# Altium project Analog_drum.PrjPcb
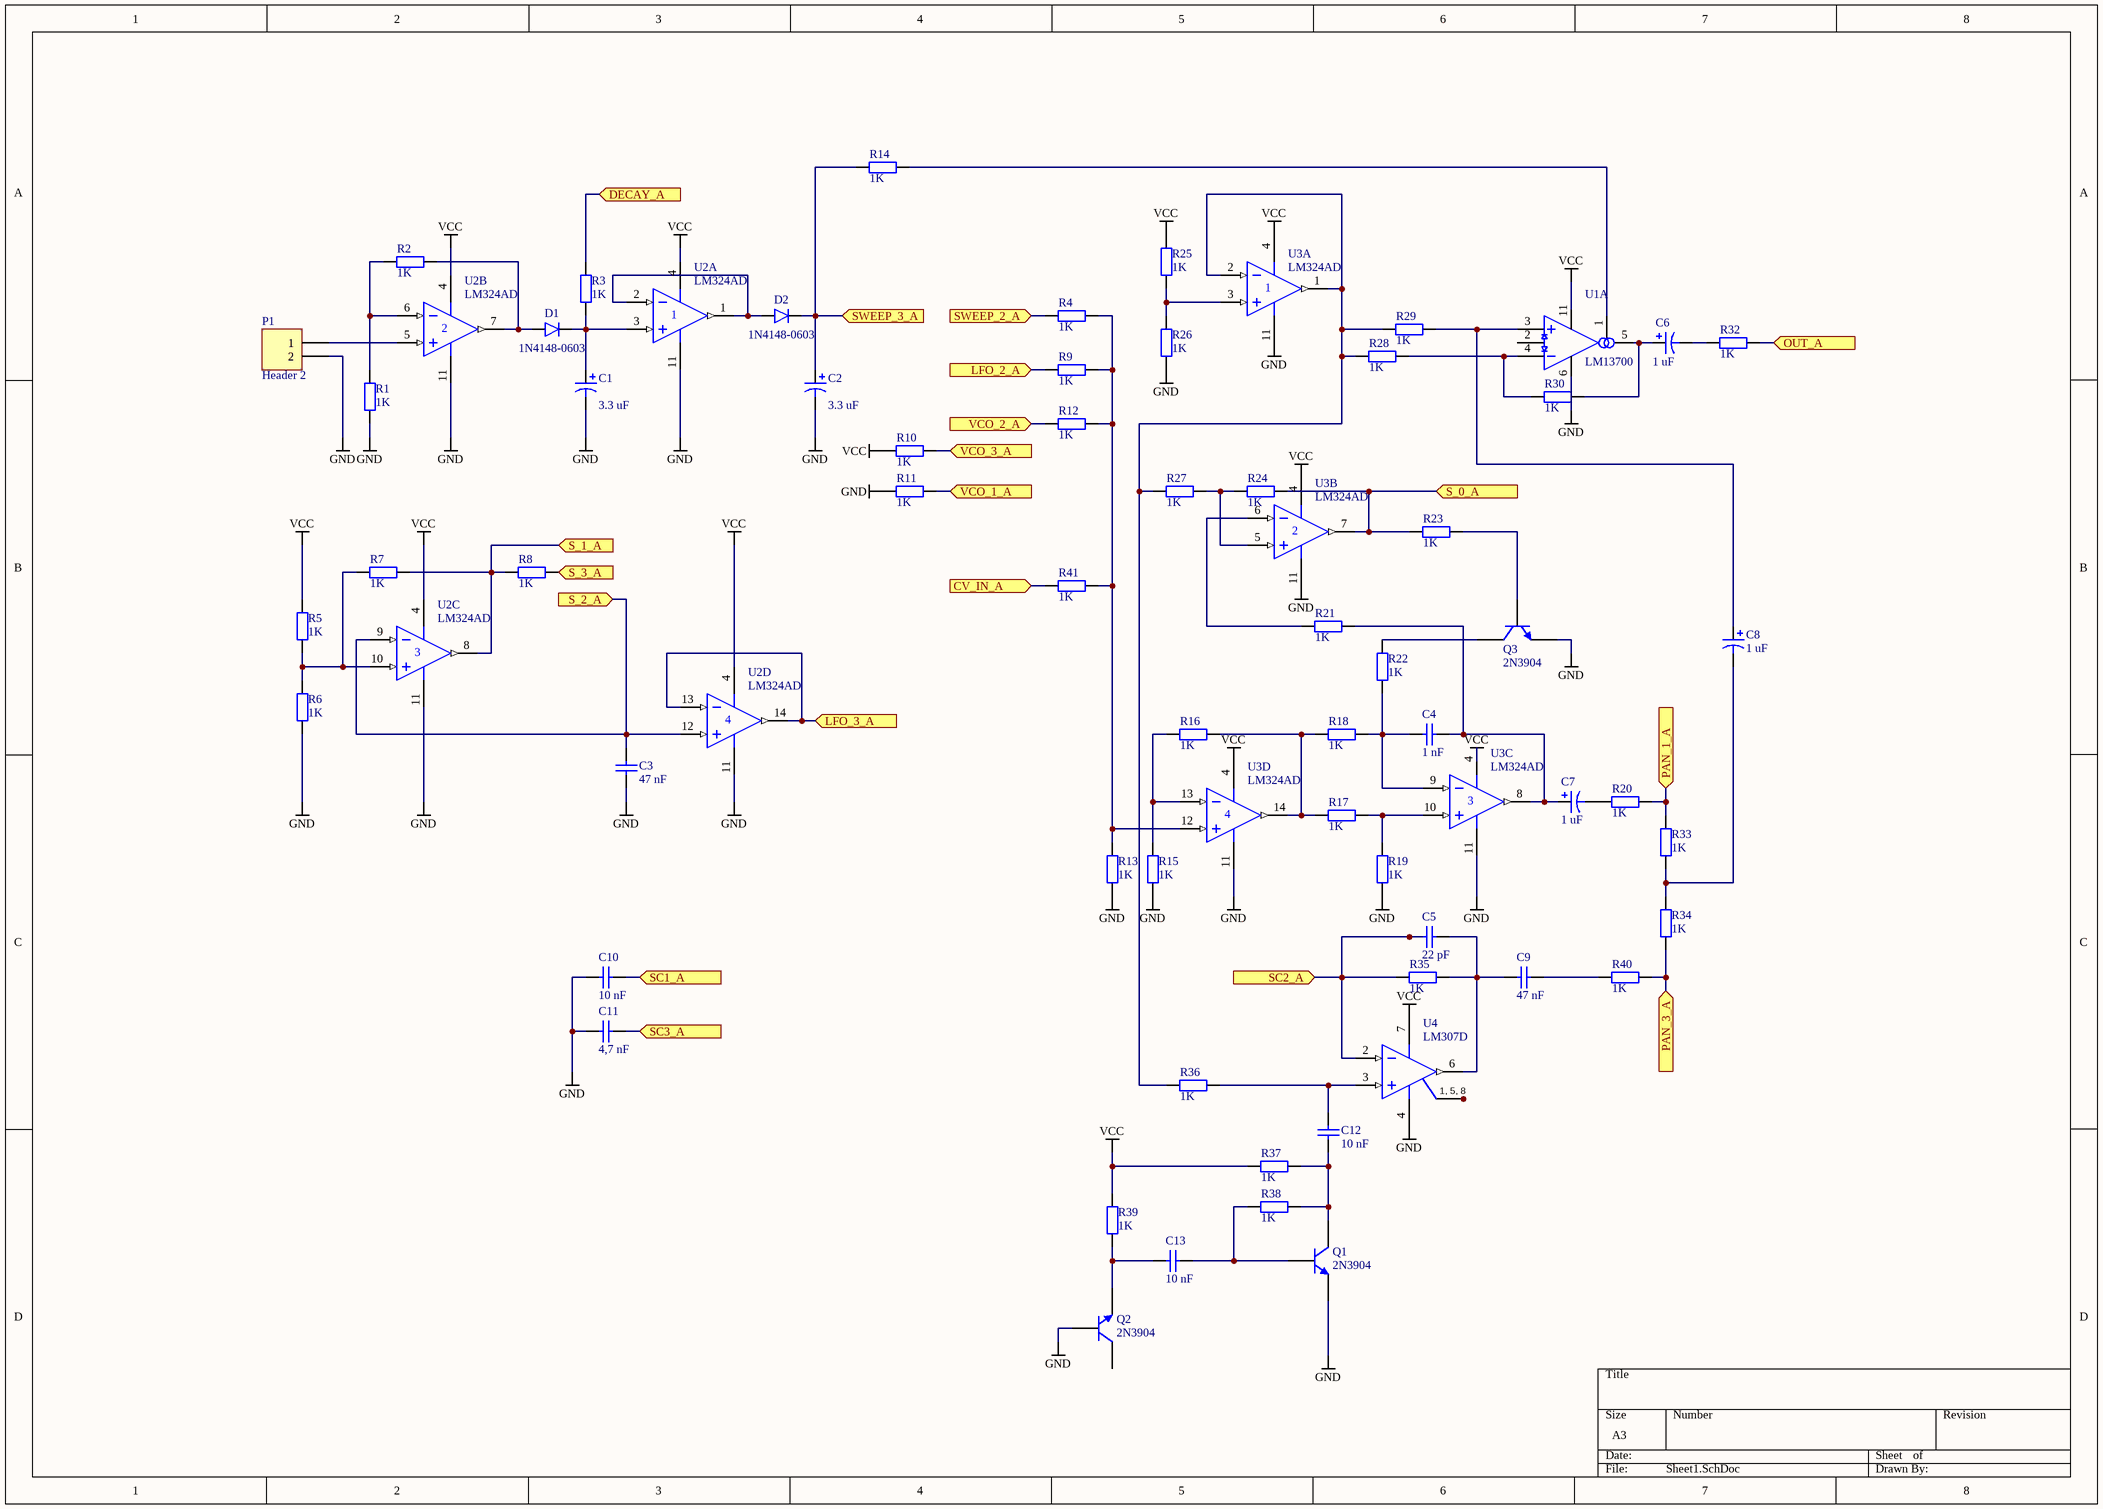
[diagram p0: Sheet1.SchDoc]
3 sheets, 150 parts. Net scope: flat (ports and power ports of the same name join across sheets).
Board file: PCB1.PcbDoc
Sheets:
  Sheet1.SchDoc
  Sheet2.SchDoc
  Sheet3.SchDoc

## Sheet Sheet1.SchDoc
size A3

### Parts
C1  value 3.3 uF  [C1206]  (hidden comment: Cap Pol1)
C2  value 3.3 uF  [C1206]  (hidden comment: Cap Pol1)
C3  value 47 nF  [C1206]  (hidden comment: Cap)
C4  value 1 nF  [C1206]  (hidden comment: Cap)
C5  value 22 pF  [C1206]  (hidden comment: Cap)
C6  value 1 uF  [C1206]  (hidden comment: Cap Pol1)
C7  value 1 uF  [C1206]  (hidden comment: Cap Pol1)
C8  value 1 uF  [C1206]  (hidden comment: Cap Pol1)
C9  value 47 nF  [C1206]  (hidden comment: Cap)
C10  value 10 nF  [C1206]  (hidden comment: Cap)
C11  value 4,7 nF  [C1206]  (hidden comment: Cap)
C12  value 10 nF  [C1206]  (hidden comment: Cap)
C13  value 10 nF  [C1206]  (hidden comment: Cap)
D1  1N4148-0603  [D0603]
D2  1N4148-0603  [D0603]
P1  Header 2  [HDR1X2]
Q1  2N3904  [TO-92A]
Q2  2N3904  [TO-92A]
Q3  2N3904  [TO-92A]
R1  value 1K  [R1206]  (hidden comment: Res2)
R2  value 1K  [R1206]  (hidden comment: Res2)
R3  value 1K  [R1206]  (hidden comment: Res2)
R4  value 1K  [R1206]  (hidden comment: Res2)
R5  value 1K  [R1206]  (hidden comment: Res2)
R6  value 1K  [R1206]  (hidden comment: Res2)
R7  value 1K  [R1206]  (hidden comment: Res2)
R8  value 1K  [R1206]  (hidden comment: Res2)
R9  value 1K  [R1206]  (hidden comment: Res2)
R10  value 1K  [R1206]  (hidden comment: Res2)
R11  value 1K  [R1206]  (hidden comment: Res2)
R12  value 1K  [R1206]  (hidden comment: Res2)
R13  value 1K  [R1206]  (hidden comment: Res2)
R14  value 1K  [R1206]  (hidden comment: Res2)
R15  value 1K  [R1206]  (hidden comment: Res2)
R16  value 1K  [R1206]  (hidden comment: Res2)
R17  value 1K  [R1206]  (hidden comment: Res2)
R18  value 1K  [R1206]  (hidden comment: Res2)
R19  value 1K  [R1206]  (hidden comment: Res2)
R20  value 1K  [R1206]  (hidden comment: Res2)
R21  value 1K  [R1206]  (hidden comment: Res2)
R22  value 1K  [R1206]  (hidden comment: Res2)
R23  value 1K  [R1206]  (hidden comment: Res2)
R24  value 1K  [R1206]  (hidden comment: Res2)
R25  value 1K  [R1206]  (hidden comment: Res2)
R26  value 1K  [R1206]  (hidden comment: Res2)
R27  value 1K  [R1206]  (hidden comment: Res2)
R28  value 1K  [R1206]  (hidden comment: Res2)
R29  value 1K  [R1206]  (hidden comment: Res2)
R30  value 1K  [R1206]  (hidden comment: Res2)
R32  value 1K  [R1206]  (hidden comment: Res2)
R33  value 1K  [R1206]  (hidden comment: Res2)
R34  value 1K  [R1206]  (hidden comment: Res2)
R35  value 1K  [R1206]  (hidden comment: Res2)
R36  value 1K  [R1206]  (hidden comment: Res2)
R37  value 1K  [R1206]  (hidden comment: Res2)
R38  value 1K  [R1206]  (hidden comment: Res2)
R39  value 1K  [R1206]  (hidden comment: Res2)
R40  value 1K  [R1206]  (hidden comment: Res2)
R41  value 1K  [R1206]  (hidden comment: Res2)
U1  LM13700  [SOIC16]  (part A of 2)
U2  LM324AD  [D014_N]  (parts A,B,C,D of 4)
U3  LM324AD  [D014_N]  (parts A,B,C,D of 4)
U4  LM307D  [D008_L]

### Ports
CV_IN_A, DECAY_A, LFO_2_A, LFO_3_A, OUT_A, PAN_1_A, PAN_3_A, S_0_A, S_1_A, S_2_A, S_3_A, SC1_A, SC2_A, SC3_A, SWEEP_2_A, SWEEP_3_A, VCO_1_A, VCO_2_A, VCO_3_A

### Nets
GND: C1.2 C2.2 C3.1 C10.2 C11.2 P1.2 Q1.1(E) Q2.2(B) Q3.1(E) R1.1 R6.1 R11.2 R13.2 R15.1 R19.2 R26.2 U1.6(V-) U2.11(V-) U3.11(V-) U4.4(V-)
VCC: R5.2 R10.1 R25.1 R37.2 R39.1 U1.11(V+) U2.4(V+) U3.4(V+) U4.7(V+)
NetC1_1: C1.1 D1.1 R3.2 U2.3(IN+)
NetC2_1: C2.1 D2.1 R14.1 ; port SWEEP_3_A
NetC3_2: C3.2 U2.9(IN-) U2.12(IN+) ; port S_2_A
NetC4_1: C4.1 C7.1 R21.2 U3.8(OUT)
NetC4_2: C4.2 R18.1 R22.1 U3.9(IN-)
NetC5_1: C5.1 C9.1 R35.1 U4.6(OUT)
NetC5_2: C5.2 R35.2 U4.2(IN-) ; port SC2_A
NetC6_1: C6.1 R30.2 U1.5(amp_bias)
NetC6_2: C6.2 R32.1
NetC7_2: C7.2 R20.1
NetC8_1: C8.1 R29.2 U1.3(+)
NetC8_2: C8.2 R33.1 R34.2
NetC9_2: C9.2 R40.1
NetC10_1: C10.1 ; port SC1_A
NetC11_1: C11.1 ; port SC3_A
NetC12_1: C12.1 R36.1 U4.3(IN+)
NetC12_2: C12.2 Q1.3(C) R37.1 R38.1
NetC13_1: C13.1 Q2.1(E) R39.2
NetC13_2: C13.2 Q1.2(B) R38.2
NetD1_2: D1.2 R2.1 U2.7(OUT)
NetD2_2: D2.2 U2.1(OUT) U2.2(IN-)
NetP1_1: P1.1 U2.5(IN+)
NetP202_1: R41.1 ; port CV_IN_A
NetPot1_1: R3.1 ; port DECAY_A
NetPot2_2: R4.1 ; port SWEEP_2_A
NetPot3_1: R8.1 ; port S_3_A
NetPot4_2: R9.2 ; port LFO_2_A
NetPot4_3: U2.13(IN-) U2.14(OUT) ; port LFO_3_A
NetPot5_1: R11.1 ; port VCO_1_A
NetPot5_2: R12.2 ; port VCO_2_A
NetPot5_3: R10.2 ; port VCO_3_A
NetPot6_1: R20.2 R33.2 ; port PAN_1_A
NetPot6_3: R34.1 R40.2 ; port PAN_3_A
NetPot7_1: R32.2 ; port OUT_A
NetQ3_2: Q3.2(B) R23.1
NetQ3_3: Q3.3(C) R22.2
NetR1_2: R1.2 R2.2 U2.6(IN-)
NetR4_2: R4.2 R9.1 R12.1 R13.1 R41.2 U3.12(IN+)
NetR5_1: R5.1 R6.2 R7.2 U2.10(IN+)
NetR7_1: R7.1 R8.2 U2.8(OUT) ; port S_1_A
NetR14_2: R14.2 U1.1(amp_bias)
NetR15_2: R15.2 R16.2 U3.13(IN-)
NetR16_1: R16.1 R17.2 R18.2 U3.14(OUT)
NetR17_1: R17.1 R19.1 U3.10(IN+)
NetR21_1: R21.1 U3.6(IN-)
NetR23_2: R23.2 R24.1 U3.7(OUT) ; port S_0_A
NetR24_2: R24.2 R27.2 U3.5(IN+)
NetR25_2: R25.2 R26.1 U3.3(IN+)
NetR27_1: R27.1 R28.1 R29.1 R36.2 U3.1(OUT) U3.2(IN-)
NetR28_2: R28.2 R30.1 U1.4(amp_bias)
NetU4_1: U4.1(NC) U4.5(NC) U4.8(NC)

Not connected (* = marked no-connect by the designer): Q2 3(C); U1 2(amp_bias)

### Notes on the sheet
- (in symbol LM307D) 1, 5, 8

### Library data of the parts
C1 C2 C6-C8 = Cap Pol1: Polarized Capacitor (Radial); Published: 8-Jun-2000; LatestRevisionDate: 17-Jul-2002; LatestRevisionNote: Re-released for DXP Platform.; PackageReference: RB7.6-15; Publisher: Altium Limited; PackageDescription: Polarized Capacitor (Radial); 2 Leads
C3-C5 C9-C13 = Cap: Capacitor; Published: 8-Jun-2000; LatestRevisionDate: 17-Jul-2002; LatestRevisionNote: Re-released for DXP Platform.; PackageReference: RAD-0.3; Publisher: Altium Limited; PackageDescription: Radial Cap, Thru-Hole; 2 Leads; 0.3 in Pin Spacing
D1 D2 = 1N4148: Dioda: przełączająca; SMD; 100V; 150mA; 4ns; 0603; Manufacture: DC COMPONENTS; Shop1: TME; DafaultFootprint: 0603; Value1: 75V; Parameter1: Vr; Parameter2: If; ComponentLink1URL: http://www.tme.eu/pl/Document/56f18f971963fb7c3e40973a6fd3d82c/CD4148W_WT.pdf; ComponentLink2URL: *; ComponentLink1Description: Datasheet; ComponentLink2Description: *; Tolerance1: *; Shop1ID: *; ComponentType: Diod Rectifier; Assembly: SMD; Replacement: *; ComponentSymbol: 1N4148-0603; Value2: 150mA
P1 = Header 2: Header, 2-Pin; LatestRevisionDate: 17-Jul-2002; LatestRevisionNote: Re-released for DXP Platform.; Publisher: Altium Limited
Q1-Q3 = 2N3904: NPN General Purpose Amplifier; Published: 8-Jun-2000; LatestRevisionDate: 15-Jan-2003; LatestRevisionNote: PCB Footprint 'BCY-W3/D4.7' replaced; DatasheetVersion: 1997; PackageVersion: Sep-1998; PackageReference: TO-92A; Publisher: Altium Limited; PackageDescription: TO, Flat Index; 3 In-Line, Axial Leads; Body Dia. 4.5mm; Leads 0.51 x 0.48 mm (max); ComponentLink1Description: Manufacturer Link; ComponentLink1URL: http://www.fairchildsemi.com/; ComponentLink2Description: Datasheet; ComponentLink2URL: http://www.fairchildsemi.com/ds/2N%2F2N3904.pdf
R1-R30 R32-R41 = Res2: Resistor; Published: 8-Jun-2000; LatestRevisionDate: 17-Jul-2002; LatestRevisionNote: Re-released for DXP Platform.; PackageReference: AXIAL-0.4; Publisher: Altium Limited; PackageDescription: Axial Device, Thru-Hole; 2 Leads; 0.4 in Pin Spacing
U2 U3 = LM324AD: Quadruple Operational Amplifier; Published: 15-Apr-2002; LatestRevisionDate: 13-Apr-2006; LatestRevisionNote: IPC-7351 Footprint Added.; DatasheetVersion: Jan-1989; PackageVersion: Jan-1998; PackageReference: D014; Publisher: Altium Limited; PackageDescription: 14-Pin Small Outline Integrated Circuit 1.27 mm Pitch; Code_IPC: SOIC127P600-14; ComponentLink1Description: Manufacturer Link; ComponentLink1URL: http://www.ti.com/; ComponentLink2Description: Datasheet; ComponentLink2URL: http://www-s.ti.com/sc/ds/lm324.pdf
U4 = LM307D: High-Performance Operational Amplifier; Published: 15-Apr-2002; LatestRevisionDate: 13-Apr-2006; LatestRevisionNote: IPC-7351 Footprint Added.; DatasheetVersion: Jun-1988; PackageVersion: Jan-1998; PackageReference: D008; Publisher: Altium Limited; PackageDescription: 8-Pin Small Outline Integrated Circuit 1.27 mm Pitch; Code_IPC: SOIC127P600-8; ComponentLink1Description: Manufacturer Link; ComponentLink1URL: http://www.ti.com/; ComponentLink2Description: Datasheet; ComponentLink2URL: http://www-s.ti.com/sc/ds/lm307.pdf

## Sheet Sheet2.SchDoc
size A3
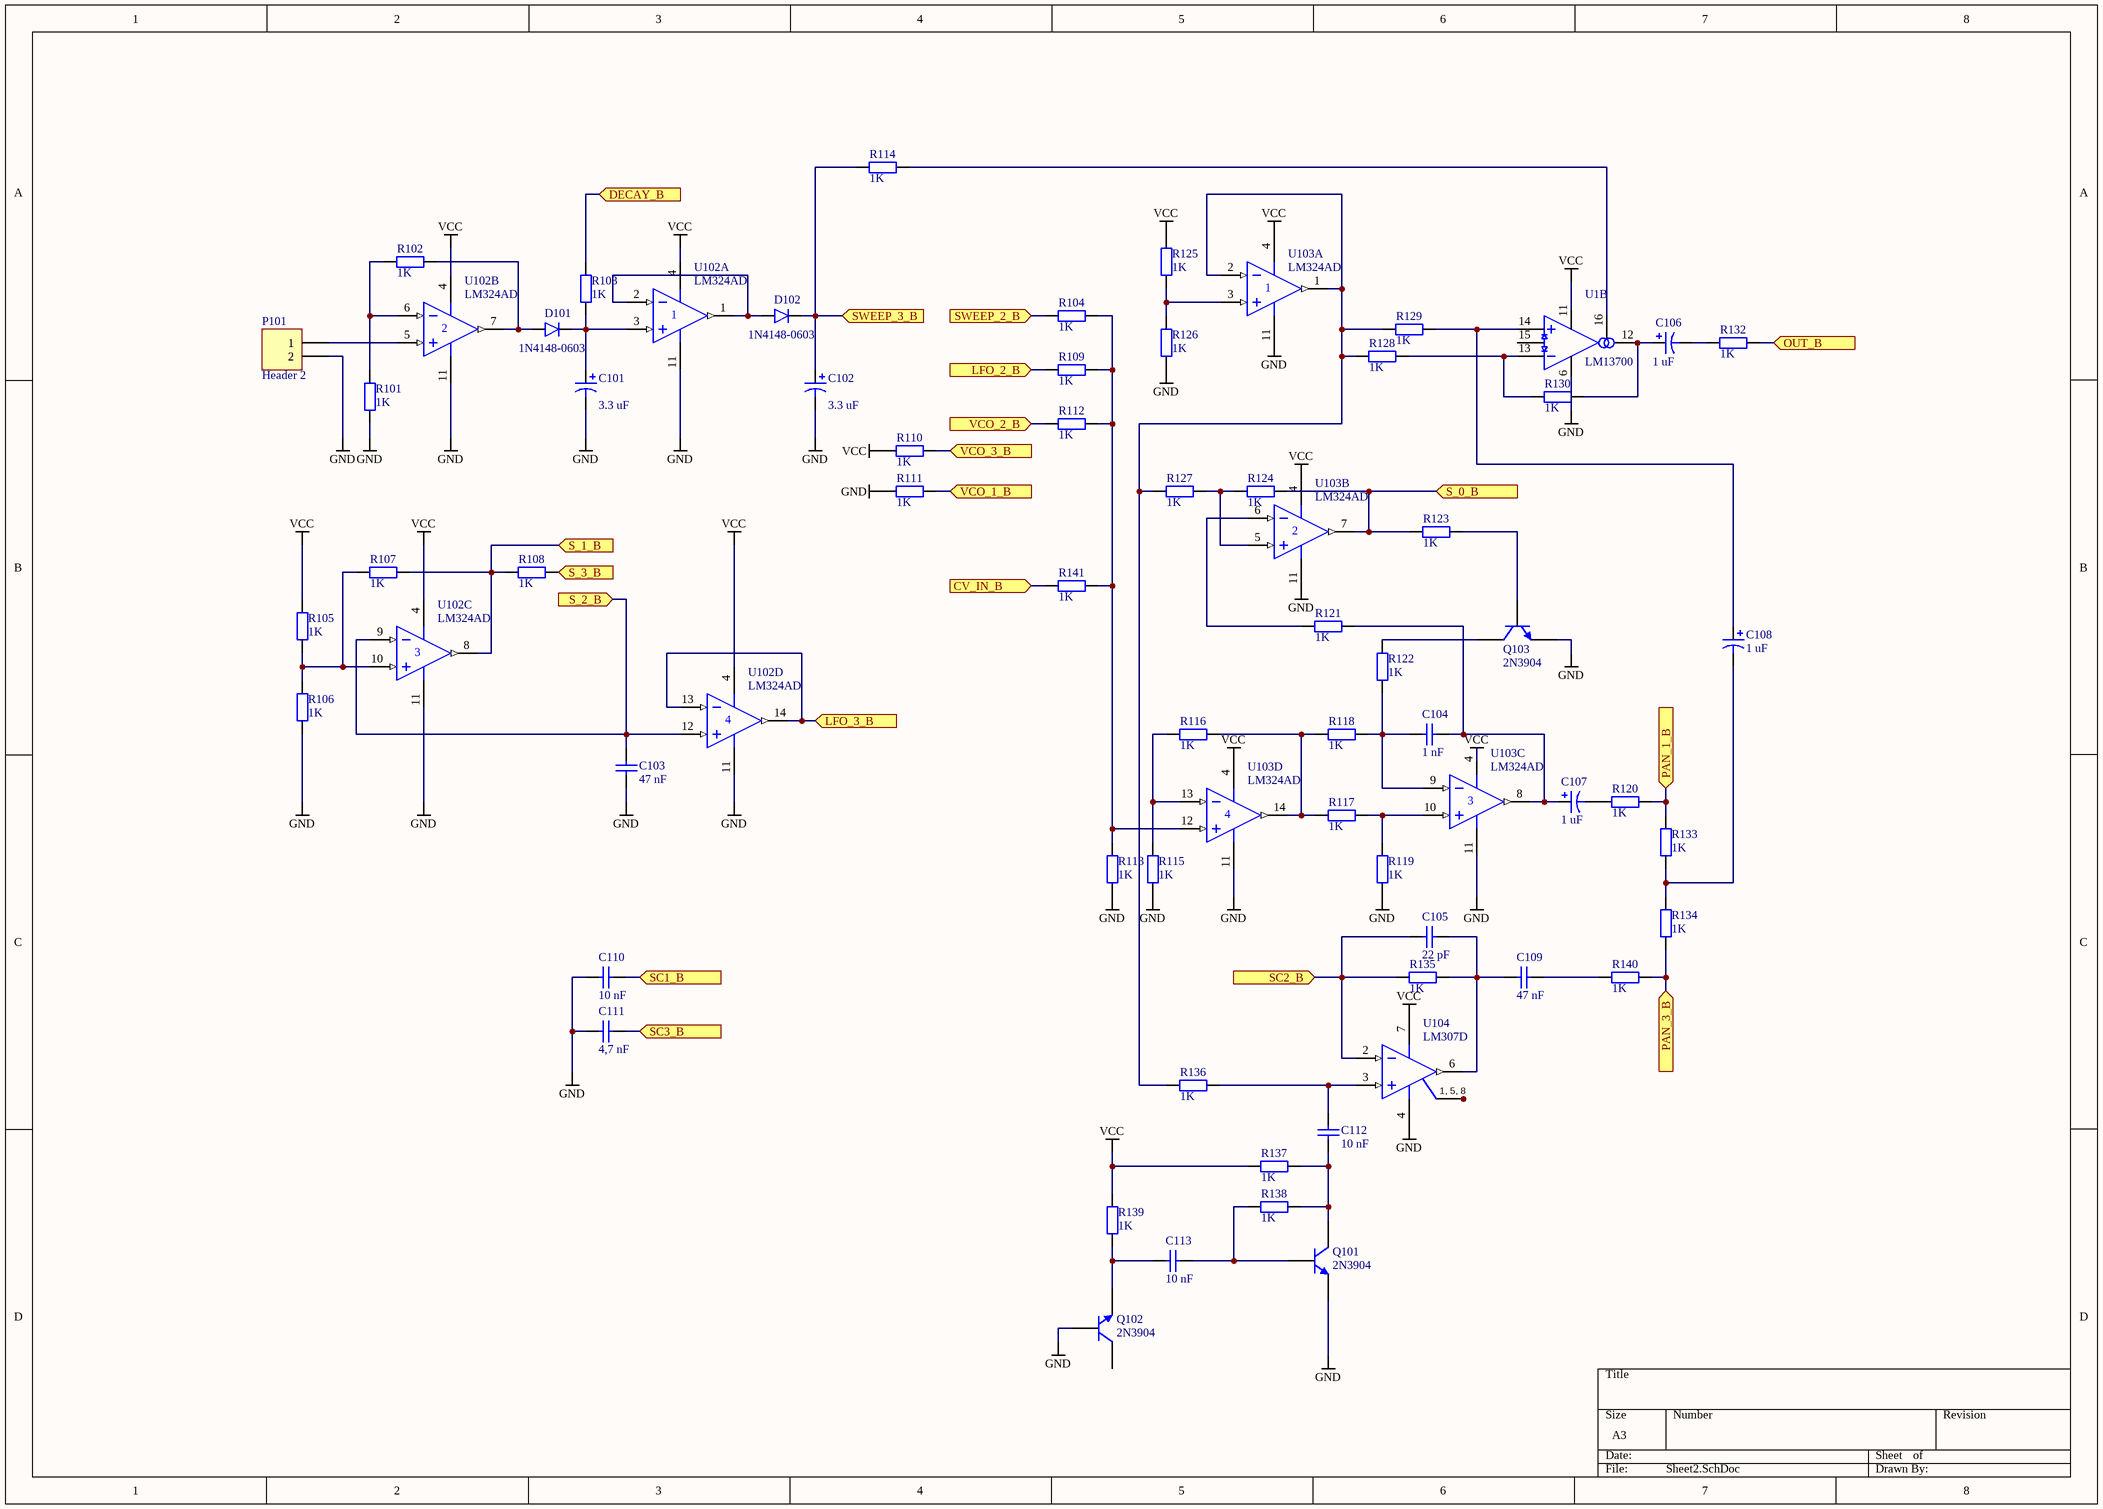
[diagram p1: Sheet2.SchDoc]

### Parts
C101  value 3.3 uF  [C1206]  (hidden comment: Cap Pol1)
C102  value 3.3 uF  [C1206]  (hidden comment: Cap Pol1)
C103  value 47 nF  [C1206]  (hidden comment: Cap)
C104  value 1 nF  [C1206]  (hidden comment: Cap)
C105  value 22 pF  [C1206]  (hidden comment: Cap)
C106  value 1 uF  [C1206]  (hidden comment: Cap Pol1)
C107  value 1 uF  [C1206]  (hidden comment: Cap Pol1)
C108  value 1 uF  [C1206]  (hidden comment: Cap Pol1)
C109  value 47 nF  [C1206]  (hidden comment: Cap)
C110  value 10 nF  [C1206]  (hidden comment: Cap)
C111  value 4,7 nF  [C1206]  (hidden comment: Cap)
C112  value 10 nF  [C1206]  (hidden comment: Cap)
C113  value 10 nF  [C1206]  (hidden comment: Cap)
D101  1N4148-0603  [D0603]
D102  1N4148-0603  [D0603]
P101  Header 2  [HDR1X2]
Q101  2N3904  [TO-92A]
Q102  2N3904  [TO-92A]
Q103  2N3904  [TO-92A]
R101  value 1K  [R1206]  (hidden comment: Res2)
R102  value 1K  [R1206]  (hidden comment: Res2)
R103  value 1K  [R1206]  (hidden comment: Res2)
R104  value 1K  [R1206]  (hidden comment: Res2)
R105  value 1K  [R1206]  (hidden comment: Res2)
R106  value 1K  [R1206]  (hidden comment: Res2)
R107  value 1K  [R1206]  (hidden comment: Res2)
R108  value 1K  [R1206]  (hidden comment: Res2)
R109  value 1K  [R1206]  (hidden comment: Res2)
R110  value 1K  [R1206]  (hidden comment: Res2)
R111  value 1K  [R1206]  (hidden comment: Res2)
R112  value 1K  [R1206]  (hidden comment: Res2)
R113  value 1K  [R1206]  (hidden comment: Res2)
R114  value 1K  [R1206]  (hidden comment: Res2)
R115  value 1K  [R1206]  (hidden comment: Res2)
R116  value 1K  [R1206]  (hidden comment: Res2)
R117  value 1K  [R1206]  (hidden comment: Res2)
R118  value 1K  [R1206]  (hidden comment: Res2)
R119  value 1K  [R1206]  (hidden comment: Res2)
R120  value 1K  [R1206]  (hidden comment: Res2)
R121  value 1K  [R1206]  (hidden comment: Res2)
R122  value 1K  [R1206]  (hidden comment: Res2)
R123  value 1K  [R1206]  (hidden comment: Res2)
R124  value 1K  [R1206]  (hidden comment: Res2)
R125  value 1K  [R1206]  (hidden comment: Res2)
R126  value 1K  [R1206]  (hidden comment: Res2)
R127  value 1K  [R1206]  (hidden comment: Res2)
R128  value 1K  [R1206]  (hidden comment: Res2)
R129  value 1K  [R1206]  (hidden comment: Res2)
R130  value 1K  [R1206]  (hidden comment: Res2)
R132  value 1K  [R1206]  (hidden comment: Res2)
R133  value 1K  [R1206]  (hidden comment: Res2)
R134  value 1K  [R1206]  (hidden comment: Res2)
R135  value 1K  [R1206]  (hidden comment: Res2)
R136  value 1K  [R1206]  (hidden comment: Res2)
R137  value 1K  [R1206]  (hidden comment: Res2)
R138  value 1K  [R1206]  (hidden comment: Res2)
R139  value 1K  [R1206]  (hidden comment: Res2)
R140  value 1K  [R1206]  (hidden comment: Res2)
R141  value 1K  [R1206]  (hidden comment: Res2)
U1  LM13700  [SOIC16]  (part B of 2)
U102  LM324AD  [D014_N]  (parts A,B,C,D of 4)
U103  LM324AD  [D014_N]  (parts A,B,C,D of 4)
U104  LM307D  [D008_L]

### Ports
CV_IN_B, DECAY_B, LFO_2_B, LFO_3_B, OUT_B, PAN_1_B, PAN_3_B, S_0_B, S_1_B, S_2_B, S_3_B, SC1_B, SC2_B, SC3_B, SWEEP_2_B, SWEEP_3_B, VCO_1_B, VCO_2_B, VCO_3_B

### Nets
GND: C101.2 C102.2 C103.1 C110.2 C111.2 P101.2 Q101.1(E) Q102.2(B) Q103.1(E) R101.1 R106.1 R111.2 R113.2 R115.1 R119.2 R126.2 U1.6(V-) U102.11(V-) U103.11(V-) U104.4(V-)
VCC: R105.2 R110.1 R125.1 R137.2 R139.1 U1.11(V+) U102.4(V+) U103.4(V+) U104.7(V+)
NetC101_1: C101.1 D101.1 R103.2 U102.3(IN+)
NetC102_1: C102.1 D102.1 R114.1 ; port SWEEP_3_B
NetC103_2: C103.2 U102.9(IN-) U102.12(IN+) ; port S_2_B
NetC104_1: C104.1 C107.1 R121.2 U103.8(OUT)
NetC104_2: C104.2 R118.1 R122.1 U103.9(IN-)
NetC105_1: C105.1 C109.1 R135.1 U104.6(OUT)
NetC105_2: C105.2 R135.2 U104.2(IN-) ; port SC2_B
NetC106_1: C106.1 R130.2 U1.12(amp_bias)
NetC106_2: C106.2 R132.1
NetC107_2: C107.2 R120.1
NetC108_1: C108.1 R129.2 U1.14(+)
NetC108_2: C108.2 R133.1 R134.2
NetC109_2: C109.2 R140.1
NetC110_1: C110.1 ; port SC1_B
NetC111_1: C111.1 ; port SC3_B
NetC112_1: C112.1 R136.1 U104.3(IN+)
NetC112_2: C112.2 Q101.3(C) R137.1 R138.1
NetC113_1: C113.1 Q102.1(E) R139.2
NetC113_2: C113.2 Q101.2(B) R138.2
NetD101_2: D101.2 R102.1 U102.7(OUT)
NetD102_2: D102.2 U102.1(OUT) U102.2(IN-)
NetP101_1: P101.1 U102.5(IN+)
NetP204_1: R141.1 ; port CV_IN_B
NetPot8_1: R103.1 ; port DECAY_B
NetPot9_2: R104.1 ; port SWEEP_2_B
NetPot10_1: R108.1 ; port S_3_B
NetPot11_2: R109.2 ; port LFO_2_B
NetPot11_3: U102.13(IN-) U102.14(OUT) ; port LFO_3_B
NetPot12_1: R111.1 ; port VCO_1_B
NetPot12_2: R112.2 ; port VCO_2_B
NetPot12_3: R110.2 ; port VCO_3_B
NetPot13_1: R120.2 R133.2 ; port PAN_1_B
NetPot13_3: R134.1 R140.2 ; port PAN_3_B
NetPot14_1: R132.2 ; port OUT_B
NetQ103_2: Q103.2(B) R123.1
NetQ103_3: Q103.3(C) R122.2
NetR101_2: R101.2 R102.2 U102.6(IN-)
NetR104_2: R104.2 R109.1 R112.1 R113.1 R141.2 U103.12(IN+)
NetR105_1: R105.1 R106.2 R107.2 U102.10(IN+)
NetR107_1: R107.1 R108.2 U102.8(OUT) ; port S_1_B
NetR114_2: R114.2 U1.16(amp_bias)
NetR115_2: R115.2 R116.2 U103.13(IN-)
NetR116_1: R116.1 R117.2 R118.2 U103.14(OUT)
NetR117_1: R117.1 R119.1 U103.10(IN+)
NetR121_1: R121.1 U103.6(IN-)
NetR123_2: R123.2 R124.1 U103.7(OUT) ; port S_0_B
NetR124_2: R124.2 R127.2 U103.5(IN+)
NetR125_2: R125.2 R126.1 U103.3(IN+)
NetR127_1: R127.1 R128.1 R129.1 R136.2 U103.1(OUT) U103.2(IN-)
NetR128_2: R128.2 R130.1 U1.13(amp_bias)
NetU104_1: U104.1(NC) U104.5(NC) U104.8(NC)

Not connected (* = marked no-connect by the designer): Q102 3(C); U1 15(amp_bias)

### Notes on the sheet
- (in symbol LM307D) 1, 5, 8

### Library data of the parts
C101 C102 C106-C108 = Cap Pol1: Polarized Capacitor (Radial); Published: 8-Jun-2000; LatestRevisionDate: 17-Jul-2002; LatestRevisionNote: Re-released for DXP Platform.; PackageReference: RB7.6-15; Publisher: Altium Limited; PackageDescription: Polarized Capacitor (Radial); 2 Leads
C103-C105 C109-C113 = Cap: Capacitor; Published: 8-Jun-2000; LatestRevisionDate: 17-Jul-2002; LatestRevisionNote: Re-released for DXP Platform.; PackageReference: RAD-0.3; Publisher: Altium Limited; PackageDescription: Radial Cap, Thru-Hole; 2 Leads; 0.3 in Pin Spacing
D101 D102 = 1N4148: as D1 on sheet Sheet1; ComponentLink1URL: http://www.tme.eu/pl/Document/56f18f971963fb7c3e40973a6fd3d82c/CD4148W_WT.pdf; ComponentLink2URL: *; ComponentLink1Description: Datasheet; ComponentLink2Description: *; Tolerance1: *; Shop1ID: *; ComponentType: Diod Rectifier; Assembly: SMD; Replacement: *; ComponentSymbol: 1N4148-0603; Value2: 150mA
P101 = Header 2: Header, 2-Pin; LatestRevisionDate: 17-Jul-2002; LatestRevisionNote: Re-released for DXP Platform.; Publisher: Altium Limited
Q101-Q103 = 2N3904: NPN General Purpose Amplifier; Published: 8-Jun-2000; LatestRevisionDate: 15-Jan-2003; LatestRevisionNote: PCB Footprint 'BCY-W3/D4.7' replaced; DatasheetVersion: 1997; PackageVersion: Sep-1998; PackageReference: TO-92A; Publisher: Altium Limited; PackageDescription: TO, Flat Index; 3 In-Line, Axial Leads; Body Dia. 4.5mm; Leads 0.51 x 0.48 mm (max); ComponentLink1Description: Manufacturer Link; ComponentLink1URL: http://www.fairchildsemi.com/; ComponentLink2Description: Datasheet; ComponentLink2URL: http://www.fairchildsemi.com/ds/2N%2F2N3904.pdf
R101-R130 R132-R141 = Res2: Resistor; Published: 8-Jun-2000; LatestRevisionDate: 17-Jul-2002; LatestRevisionNote: Re-released for DXP Platform.; PackageReference: AXIAL-0.4; Publisher: Altium Limited; PackageDescription: Axial Device, Thru-Hole; 2 Leads; 0.4 in Pin Spacing
U102 U103 = LM324AD: Quadruple Operational Amplifier; Published: 15-Apr-2002; LatestRevisionDate: 13-Apr-2006; LatestRevisionNote: IPC-7351 Footprint Added.; DatasheetVersion: Jan-1989; PackageVersion: Jan-1998; PackageReference: D014; Publisher: Altium Limited; PackageDescription: 14-Pin Small Outline Integrated Circuit 1.27 mm Pitch; Code_IPC: SOIC127P600-14; ComponentLink1Description: Manufacturer Link; ComponentLink1URL: http://www.ti.com/; ComponentLink2Description: Datasheet; ComponentLink2URL: http://www-s.ti.com/sc/ds/lm324.pdf
U104 = LM307D: High-Performance Operational Amplifier; Published: 15-Apr-2002; LatestRevisionDate: 13-Apr-2006; LatestRevisionNote: IPC-7351 Footprint Added.; DatasheetVersion: Jun-1988; PackageVersion: Jan-1998; PackageReference: D008; Publisher: Altium Limited; PackageDescription: 8-Pin Small Outline Integrated Circuit 1.27 mm Pitch; Code_IPC: SOIC127P600-8; ComponentLink1Description: Manufacturer Link; ComponentLink1URL: http://www.ti.com/; ComponentLink2Description: Datasheet; ComponentLink2URL: http://www-s.ti.com/sc/ds/lm307.pdf

## Sheet Sheet3.SchDoc
size A4
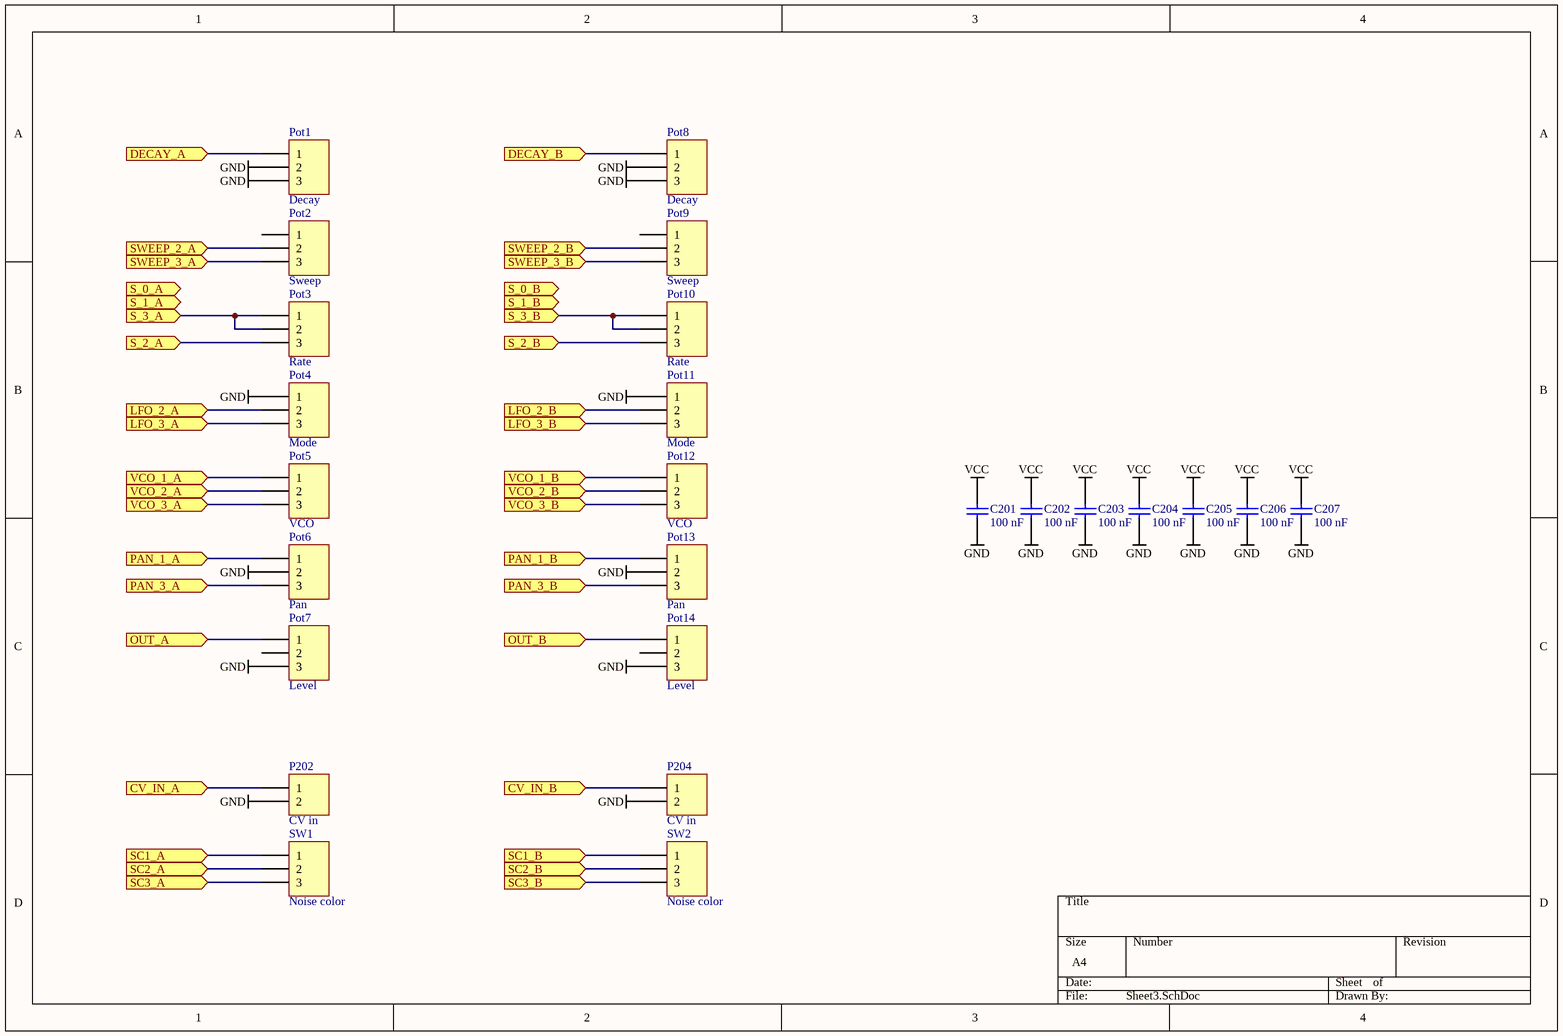
[diagram p2: Sheet3.SchDoc]

### Parts
C201  value 100 nF  [C1206]  (hidden comment: Cap)
C202  value 100 nF  [C1206]  (hidden comment: Cap)
C203  value 100 nF  [C1206]  (hidden comment: Cap)
C204  value 100 nF  [C1206]  (hidden comment: Cap)
C205  value 100 nF  [C1206]  (hidden comment: Cap)
C206  value 100 nF  [C1206]  (hidden comment: Cap)
C207  value 100 nF  [C1206]  (hidden comment: Cap)
P202  CV in  [HDR1X2]
P204  CV in  [HDR1X2]
Pot1  Decay  [HDR1X3]
Pot2  Sweep  [HDR1X3]
Pot3  Rate  [HDR1X3]
Pot4  Mode  [HDR1X3]
Pot5  VCO  [HDR1X3]
Pot6  Pan  [HDR1X3]
Pot7  Level  [HDR1X3]
Pot8  Decay  [HDR1X3]
Pot9  Sweep  [HDR1X3]
Pot10  Rate  [HDR1X3]
Pot11  Mode  [HDR1X3]
Pot12  VCO  [HDR1X3]
Pot13  Pan  [HDR1X3]
Pot14  Level  [HDR1X3]
SW1  Noise color  [HDR1X3]
SW2  Noise color  [HDR1X3]

### Ports
CV_IN_A, CV_IN_B, DECAY_A, DECAY_B, LFO_2_A, LFO_2_B, LFO_3_A, LFO_3_B, OUT_A, OUT_B, PAN_1_A, PAN_1_B, PAN_3_A, PAN_3_B, S_0_A, S_0_B, S_1_A, S_1_B, S_2_A, S_2_B, S_3_A, S_3_B, SC1_A, SC1_B, SC2_A, SC2_B, SC3_A, SC3_B, SWEEP_2_A, SWEEP_2_B, SWEEP_3_A, SWEEP_3_B, VCO_1_A, VCO_1_B, VCO_2_A, VCO_2_B, VCO_3_A, VCO_3_B

### Nets
GND: C201.2 C202.2 C203.2 C204.2 C205.2 C206.2 C207.2 P202.2 P204.2 Pot1.2 Pot1.3 Pot4.1 Pot6.2 Pot7.3 Pot8.2 Pot8.3 Pot11.1 Pot13.2 Pot14.3
VCC: C201.1 C202.1 C203.1 C204.1 C205.1 C206.1 C207.1
NetC2_1: Pot2.3 ; port SWEEP_3_A
NetC3_2: Pot3.3 ; port S_2_A
NetC5_2: SW1.2 ; port SC2_A
NetC10_1: SW1.1 ; port SC1_A
NetC11_1: SW1.3 ; port SC3_A
NetC102_1: Pot9.3 ; port SWEEP_3_B
NetC103_2: Pot10.3 ; port S_2_B
NetC105_2: SW2.2 ; port SC2_B
NetC110_1: SW2.1 ; port SC1_B
NetC111_1: SW2.3 ; port SC3_B
NetP202_1: P202.1 ; port CV_IN_A
NetP204_1: P204.1 ; port CV_IN_B
NetPot1_1: Pot1.1 ; port DECAY_A
NetPot2_2: Pot2.2 ; port SWEEP_2_A
NetPot3_1: Pot3.1 Pot3.2 ; port S_3_A
NetPot4_2: Pot4.2 ; port LFO_2_A
NetPot4_3: Pot4.3 ; port LFO_3_A
NetPot5_1: Pot5.1 ; port VCO_1_A
NetPot5_2: Pot5.2 ; port VCO_2_A
NetPot5_3: Pot5.3 ; port VCO_3_A
NetPot6_1: Pot6.1 ; port PAN_1_A
NetPot6_3: Pot6.3 ; port PAN_3_A
NetPot7_1: Pot7.1 ; port OUT_A
NetPot8_1: Pot8.1 ; port DECAY_B
NetPot9_2: Pot9.2 ; port SWEEP_2_B
NetPot10_1: Pot10.1 Pot10.2 ; port S_3_B
NetPot11_2: Pot11.2 ; port LFO_2_B
NetPot11_3: Pot11.3 ; port LFO_3_B
NetPot12_1: Pot12.1 ; port VCO_1_B
NetPot12_2: Pot12.2 ; port VCO_2_B
NetPot12_3: Pot12.3 ; port VCO_3_B
NetPot13_1: Pot13.1 ; port PAN_1_B
NetPot13_3: Pot13.3 ; port PAN_3_B
NetPot14_1: Pot14.1 ; port OUT_B

Not connected (* = marked no-connect by the designer): Pot2 1; Pot7 2; Pot9 1; Pot14 2

### Library data of the parts
C201-C207 = Cap: Capacitor; Published: 8-Jun-2000; LatestRevisionDate: 17-Jul-2002; LatestRevisionNote: Re-released for DXP Platform.; PackageReference: RAD-0.3; Publisher: Altium Limited; PackageDescription: Radial Cap, Thru-Hole; 2 Leads; 0.3 in Pin Spacing
P202 P204 = Header 2: Header, 2-Pin; LatestRevisionDate: 17-Jul-2002; LatestRevisionNote: Re-released for DXP Platform.; Publisher: Altium Limited
Pot1-Pot14 SW1 SW2 = Header 3: Header, 3-Pin; LatestRevisionDate: 17-Jul-2002; LatestRevisionNote: Re-released for DXP Platform.; Publisher: Altium Limited

## Nets that join several sheets
GND: Sheet1 (20 pins), Sheet2 (20 pins), Sheet3 (19 pins)
VCC: Sheet1 (9 pins), Sheet2 (9 pins), Sheet3 (7 pins)
NetC2_1: Sheet1 (C2.1 D2.1 R14.1), Sheet3 (Pot2.3)
NetC3_2: Sheet1 (C3.2 U2.9 U2.12), Sheet3 (Pot3.3)
NetC5_2: Sheet1 (C5.2 R35.2 U4.2), Sheet3 (SW1.2)
NetC10_1: Sheet1 (C10.1), Sheet3 (SW1.1)
NetC11_1: Sheet1 (C11.1), Sheet3 (SW1.3)
NetC102_1: Sheet2 (C102.1 D102.1 R114.1), Sheet3 (Pot9.3)
NetC103_2: Sheet2 (C103.2 U102.9 U102.12), Sheet3 (Pot10.3)
NetC105_2: Sheet2 (C105.2 R135.2 U104.2), Sheet3 (SW2.2)
NetC110_1: Sheet2 (C110.1), Sheet3 (SW2.1)
NetC111_1: Sheet2 (C111.1), Sheet3 (SW2.3)
NetP202_1: Sheet1 (R41.1), Sheet3 (P202.1)
NetP204_1: Sheet2 (R141.1), Sheet3 (P204.1)
NetPot1_1: Sheet1 (R3.1), Sheet3 (Pot1.1)
NetPot2_2: Sheet1 (R4.1), Sheet3 (Pot2.2)
NetPot3_1: Sheet1 (R8.1), Sheet3 (Pot3.1 Pot3.2)
NetPot4_2: Sheet1 (R9.2), Sheet3 (Pot4.2)
NetPot4_3: Sheet1 (U2.13 U2.14), Sheet3 (Pot4.3)
NetPot5_1: Sheet1 (R11.1), Sheet3 (Pot5.1)
NetPot5_2: Sheet1 (R12.2), Sheet3 (Pot5.2)
NetPot5_3: Sheet1 (R10.2), Sheet3 (Pot5.3)
NetPot6_1: Sheet1 (R20.2 R33.2), Sheet3 (Pot6.1)
NetPot6_3: Sheet1 (R34.1 R40.2), Sheet3 (Pot6.3)
NetPot7_1: Sheet1 (R32.2), Sheet3 (Pot7.1)
NetPot8_1: Sheet2 (R103.1), Sheet3 (Pot8.1)
NetPot9_2: Sheet2 (R104.1), Sheet3 (Pot9.2)
NetPot10_1: Sheet2 (R108.1), Sheet3 (Pot10.1 Pot10.2)
NetPot11_2: Sheet2 (R109.2), Sheet3 (Pot11.2)
NetPot11_3: Sheet2 (U102.13 U102.14), Sheet3 (Pot11.3)
NetPot12_1: Sheet2 (R111.1), Sheet3 (Pot12.1)
NetPot12_2: Sheet2 (R112.2), Sheet3 (Pot12.2)
NetPot12_3: Sheet2 (R110.2), Sheet3 (Pot12.3)
NetPot13_1: Sheet2 (R120.2 R133.2), Sheet3 (Pot13.1)
NetPot13_3: Sheet2 (R134.1 R140.2), Sheet3 (Pot13.3)
NetPot14_1: Sheet2 (R132.2), Sheet3 (Pot14.1)